# Altium project BaseBoard.PrjPcb (part 1 of 2)
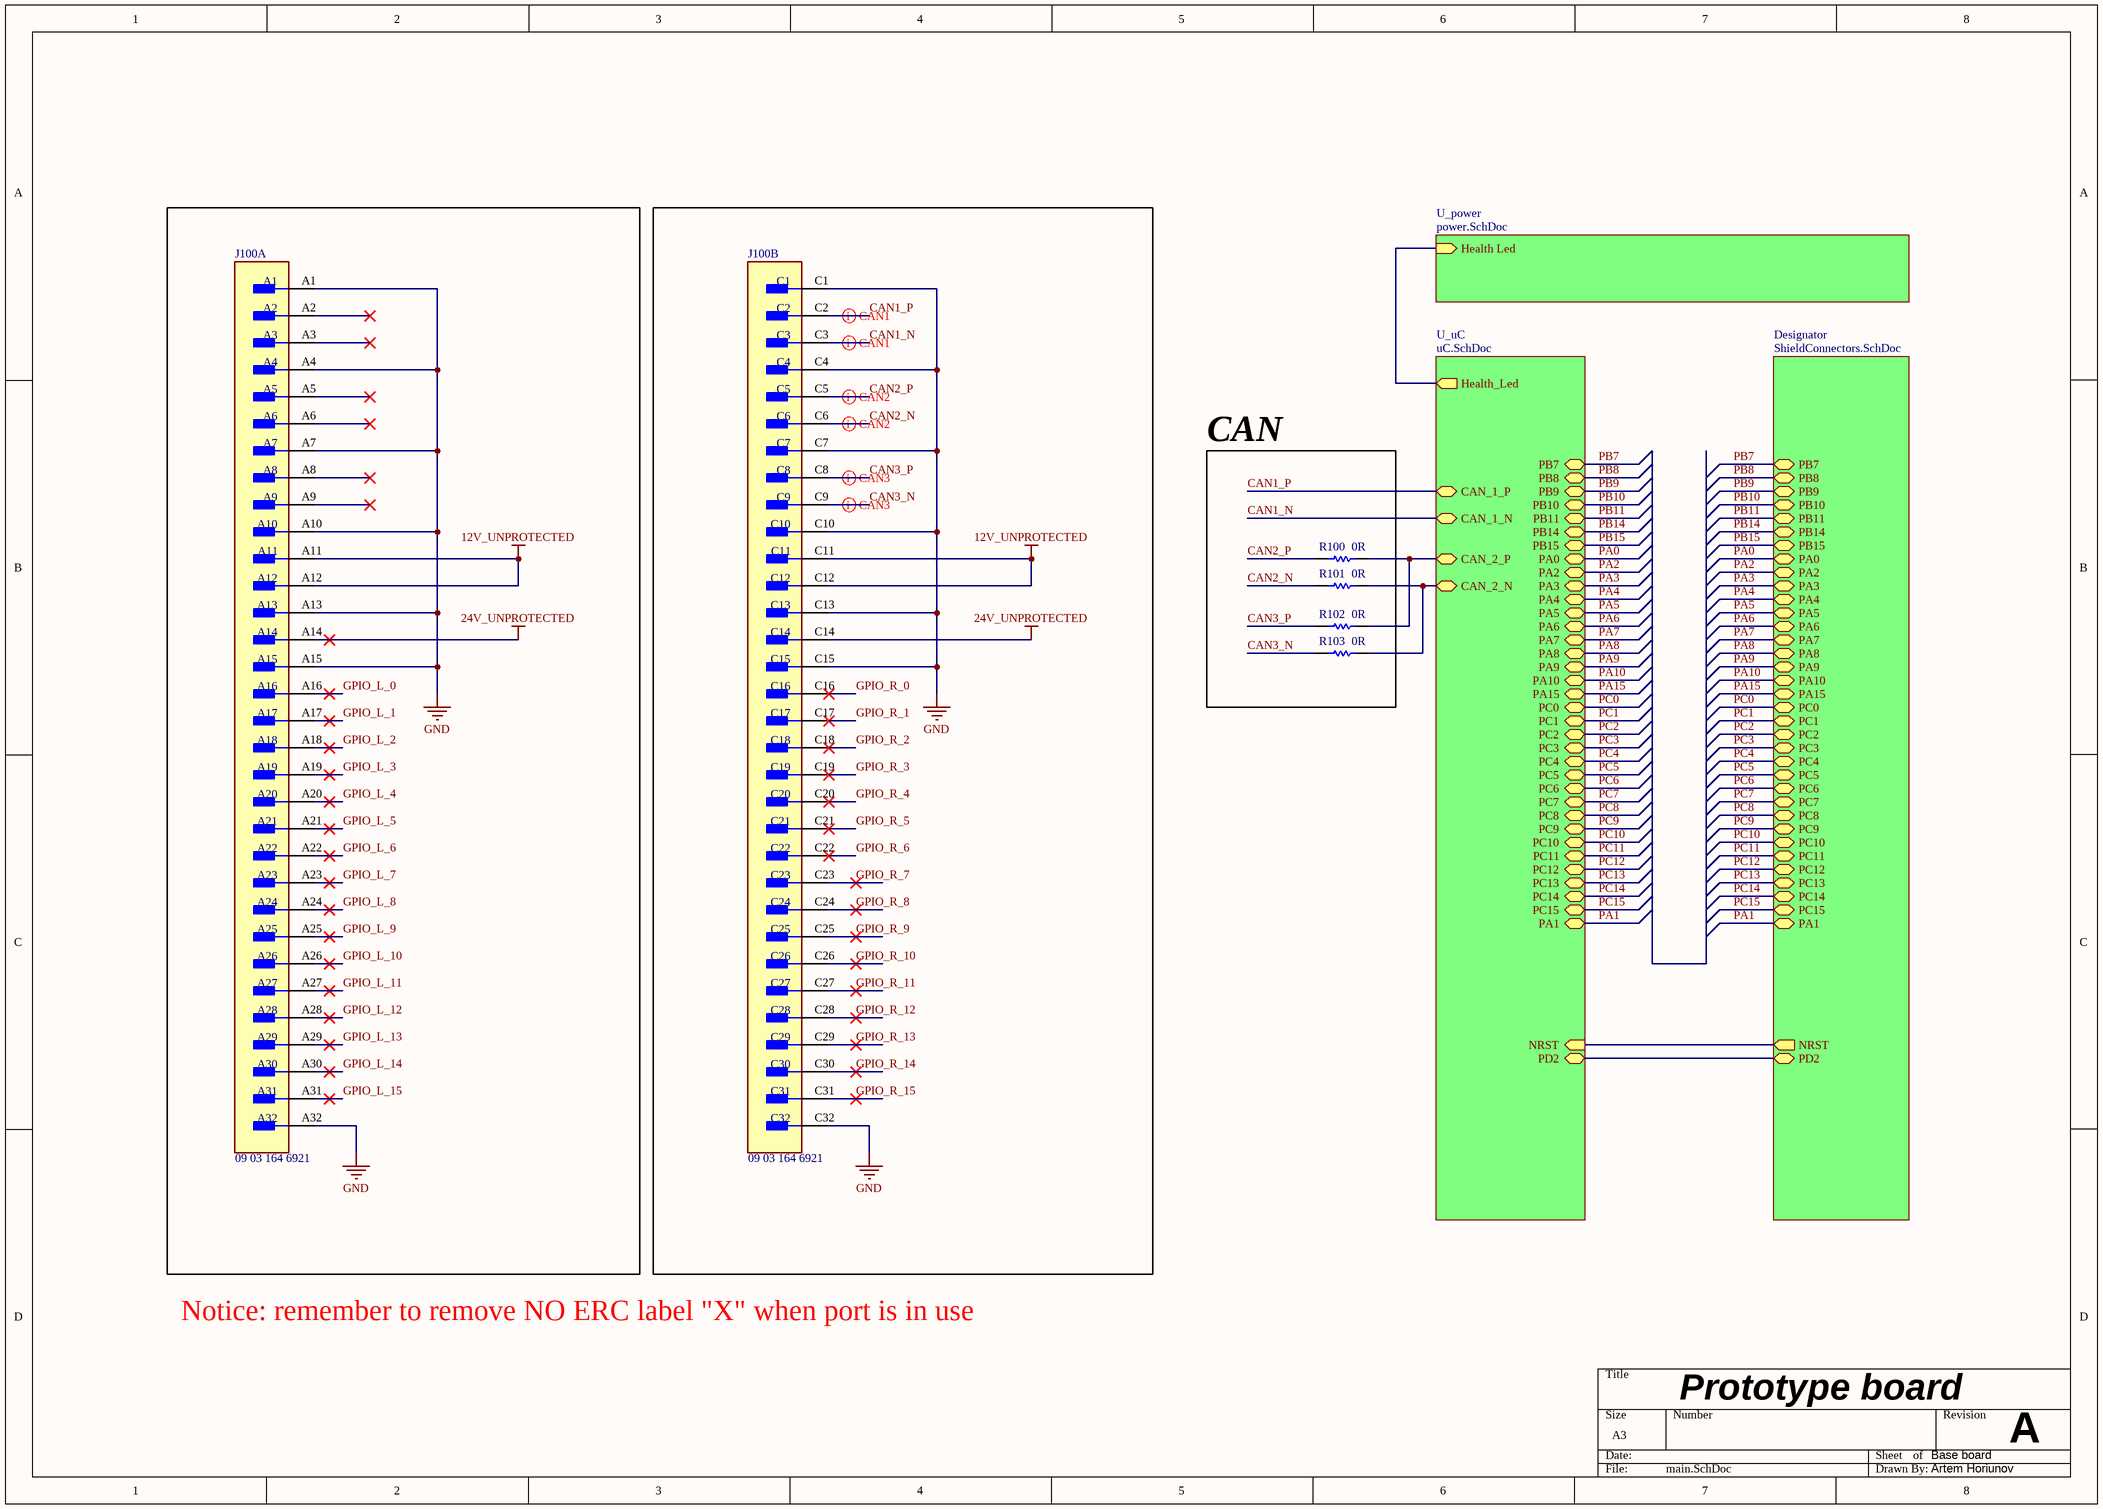
[diagram p0: main.SchDoc]
4 sheets, 129 parts. Net scope: hierarchical (ports join the sheet entries above them; power ports are global).
Board files: BaseBoard.PcbDoc, Buck3v3.PcbDoc, Buck5v.PcbDoc
Sheets:
  main.SchDoc
    U_power = power.SchDoc
    U_uC = uC.SchDoc
    Designator = ShieldConnectors.SchDoc

## Sheet main.SchDoc
size A3; SheetNumber: 1; SheetTotal: 4

### Parts
J100  09 03 164 6921  [FP-09_03_164_6921-MFG]  (parts A,B of 2)
R100  0R  [RESC1608X55X25ML10T15]
R101  0R  [RESC1608X55X25ML10T15]
R102  0R  [RESC1608X55X25ML10T15]
R103  0R  [RESC1608X55X25ML10T15]

### Blocks framed on the sheet
CAN: R100-R103

### Sub-sheets
Designator = ShieldConnectors.SchDoc: PB7 (bidir), PB8 (bidir), PB9 (bidir), PB10 (bidir), PB11 (bidir), PB14 (bidir), PB15 (bidir), PA0 (bidir), PA2 (bidir), PA3 (bidir), PA4 (bidir), PA5 (bidir), PA6 (bidir), PA7 (bidir), PA8 (bidir), PA9 (bidir), PA10 (bidir), PC5 (bidir), PC4 (bidir), PC7 (bidir), PC6 (bidir), PC1 (bidir), PC0 (bidir), PC3 (bidir), PC2 (bidir), PC8 (bidir), PC14 (bidir), PC13 (bidir), PA15 (bidir), PC15 (bidir), PC10 (bidir), PC9 (bidir), PC12 (bidir), PC11 (bidir), NRST (out), PD2 (bidir), PA1 (bidir)
U_power = power.SchDoc: Health Led (in)
U_uC = uC.SchDoc: CAN_2_P (bidir), CAN_2_N (bidir), CAN_1_P (bidir), CAN_1_N (bidir), Health_Led (out), PB7 (bidir), PB8 (bidir), PB9 (bidir), PB10 (bidir), PB11 (bidir), PB14 (bidir), PB15 (bidir), PA0 (bidir), PA2 (bidir), PA3 (bidir), PA4 (bidir), PA5 (bidir), PA6 (bidir), PA7 (bidir), PA8 (bidir), PA9 (bidir), PA10 (bidir), PA15 (bidir), PC0 (bidir), PC1 (bidir), PC2 (bidir), PC3 (bidir), PC4 (bidir), PC5 (bidir), PC6 (bidir), PC7 (bidir), PC8 (bidir), PC9 (bidir), PC10 (bidir), PC11 (bidir), PC12 (bidir), PC13 (bidir), PC14 (bidir), PC15 (bidir), PD2 (bidir), NRST (in), PA1 (bidir)

### Nets
12V_UNPROTECTED: J100.A11 J100.A12 J100.C11 J100.C12
24V_UNPROTECTED: J100.A14 J100.C14
GND: J100.A1 J100.A4 J100.A7 J100.A10 J100.A13 J100.A15 J100.A32 J100.C1 J100.C4 J100.C7 J100.C10 J100.C13 J100.C15 J100.C32
CAN1_N: J100.C3 ; sheet U_uC/CAN_1_N
CAN1_P: J100.C2 ; sheet U_uC/CAN_1_P
CAN2_N: J100.C6 R101.1
CAN2_P: J100.C5 R100.1
CAN3_N: J100.C9 R103.1
CAN3_P: J100.C8 R102.1
CAN_2_N: R101.2 R103.2 ; sheet U_uC/CAN_2_N
CAN_2_P: R100.2 R102.2 ; sheet U_uC/CAN_2_P
GPIO_L_0: J100.A16
GPIO_L_1: J100.A17
GPIO_L_2: J100.A18
GPIO_L_3: J100.A19
GPIO_L_4: J100.A20
GPIO_L_5: J100.A21
GPIO_L_6: J100.A22
GPIO_L_7: J100.A23
GPIO_L_8: J100.A24
GPIO_L_9: J100.A25
GPIO_L_10: J100.A26
GPIO_L_11: J100.A27
GPIO_L_12: J100.A28
GPIO_L_13: J100.A29
GPIO_L_14: J100.A30
GPIO_L_15: J100.A31
GPIO_R_0: J100.C16
GPIO_R_1: J100.C17
GPIO_R_2: J100.C18
GPIO_R_3: J100.C19
GPIO_R_4: J100.C20
GPIO_R_5: J100.C21
GPIO_R_6: J100.C22
GPIO_R_7: J100.C23
GPIO_R_8: J100.C24
GPIO_R_9: J100.C25
GPIO_R_10: J100.C26
GPIO_R_11: J100.C27
GPIO_R_12: J100.C28
GPIO_R_13: J100.C29
GPIO_R_14: J100.C30
GPIO_R_15: J100.C31
NRST: sheet U_uC/NRST, sheet Designator/NRST
PA0: sheet U_uC/PA0, sheet Designator/PA0
PA1: sheet U_uC/PA1, sheet Designator/PA1
PA2: sheet U_uC/PA2, sheet Designator/PA2
PA3: sheet U_uC/PA3, sheet Designator/PA3
PA4: sheet U_uC/PA4, sheet Designator/PA4
PA5: sheet U_uC/PA5, sheet Designator/PA5
PA6: sheet U_uC/PA6, sheet Designator/PA6
PA7: sheet U_uC/PA7, sheet Designator/PA7
PA8: sheet U_uC/PA8, sheet Designator/PA8
PA9: sheet U_uC/PA9, sheet Designator/PA9
PA10: sheet U_uC/PA10, sheet Designator/PA10
PA15: sheet U_uC/PA15, sheet Designator/PA15
PB7: sheet U_uC/PB7, sheet Designator/PB7
PB8: sheet U_uC/PB8, sheet Designator/PB8  [project net LV_CL]
PB9: sheet U_uC/PB9, sheet Designator/PB9  [project net LV_DA]
PB10: sheet U_uC/PB10, sheet Designator/PB10
PB11: sheet U_uC/PB11, sheet Designator/PB11
PB14: sheet U_uC/PB14, sheet Designator/PB14
PB15: sheet U_uC/PB15, sheet Designator/PB15
PC0: sheet U_uC/PC0, sheet Designator/PC0
PC1: sheet U_uC/PC1, sheet Designator/PC1
PC2: sheet U_uC/PC2, sheet Designator/PC2
PC3: sheet U_uC/PC3, sheet Designator/PC3
PC4: sheet U_uC/PC4, sheet Designator/PC4
PC5: sheet U_uC/PC5, sheet Designator/PC5
PC6: sheet U_uC/PC6, sheet Designator/PC6
PC7: sheet U_uC/PC7, sheet Designator/PC7
PC8: sheet U_uC/PC8, sheet Designator/PC8
PC9: sheet U_uC/PC9, sheet Designator/PC9
PC10: sheet U_uC/PC10, sheet Designator/PC10
PC11: sheet U_uC/PC11, sheet Designator/PC11
PC12: sheet U_uC/PC12, sheet Designator/PC12
PC13: sheet U_uC/PC13, sheet Designator/PC13
PC14: sheet U_uC/PC14, sheet Designator/PC14
PC15: sheet U_uC/PC15, sheet Designator/PC15
USER_LED_0: sheet U_power/Health Led, sheet U_uC/Health_Led
NetJ8_4: sheet U_uC/PD2, sheet Designator/PD2

Not connected (* = marked no-connect by the designer): J100 A2* A3* A5* A6* A8* A9*

### Layout directives
differential pair: CAN1_N, CAN1_P, CAN2_N, CAN2_P, CAN3_N, CAN3_P

### Notes on the sheet
- Notice: remember to remove NO ERC label "X" when port is in use
- Prototype board
- Base board
- A
- Artem Horiunov

### Library data of the parts
J100 = CMP-33111-000001-1: CONN DIN HDR 96POS PCB RA; Manufacturer: Harting; Pitch: 2.54mm; Number Of Contacts: 64; Current Rating: 2A; Conn Orientation: Right Angle; Conn Gender: Male; Device Class L1: Connectors; Package: 0; Number Of Rows: 2; ComponentLink2URL: https://b2b.harting.com/files/download/PRD/PDF_DS/09031200203_100580339DRW000B.pdf; Height: 11mm; Temperature Range Low: -55°C; Digikey Description: CONN DIN HDR 96POS PCB RA; Mouser Description: Conn DIN 41612 M 64 POS 2.54mm Solder RA Thru-Hole Box; Footprint Url: https://b2b.harting.com/files/download/PRD/PDF_TS/0903164X921_100072506DRW176A.pdf; Lead Free: Yes; RoHS: TRUE; Device Class L2: Backplane Connectors; Category: Conn; Manufacturer Part Number: 09 03 164 6921; Temperature Range High: +125°C; Temperature: -55°C to +125°C; ComponentLink2Description: Datasheet; Octopart: https://octopart.com/09031646921-harting+elektronik-42933; Device Class L3: unset; Automotive: No; Contact Material: Gold,Nickel
R100-R103 = CMP-2100-03667-1: Chip Resistor, 0 Ohm, +/- 5%, 0.1 W, -55 to 155 degC, 0603 (1608 Metric), RoHS, Tape and Reel; Manufacturer: Yageo; Temperature Coefficient: 200ppm/degreesC; Voltage Rating: 50V; Power Rating: 100mW; Resistance: 0mOhm; Width: 0.8mm; Max Operating Temperature: 155degC; Tolerance: 5%; Package Reference: 0603; Height: 0.45mm; Depth: 0.8mm; Package Description: 2-Pin Surface Mount Device, Body 1.6 x 0.8 mm; Termination: SMD/SMT; Package Quantity: 5000; Case/Package: 0603; Case Code (Imperial): 0603; Radiation Hardening: No; Number of Pins: 2; Length: 1.6mm; Lead Free: LeadFree; Voltage Rating (DC): 50V; Military Standard: Not; Datasheet URL: http://www.yageo.com/NewPortal/yageodocoutput?fileName=/pdf/R-Chip/PYu-RC_Group_51_RoHS_L_5.pdf; Manufacturer URL: http://www.yageo.com/; Packaging: TapeandReel; Case Code (Metric): 1608; Min Operating Temperature: -55degC; Composition: ThickFilm; RoHSCompliant: true; Contact Plating: Tin; Datasheet Version: Rev. 5, 10/2016; REACH SVHC: NoSVHC

## Sheet power.SchDoc
size A3; SheetNumber: 3; SheetTotal: 4
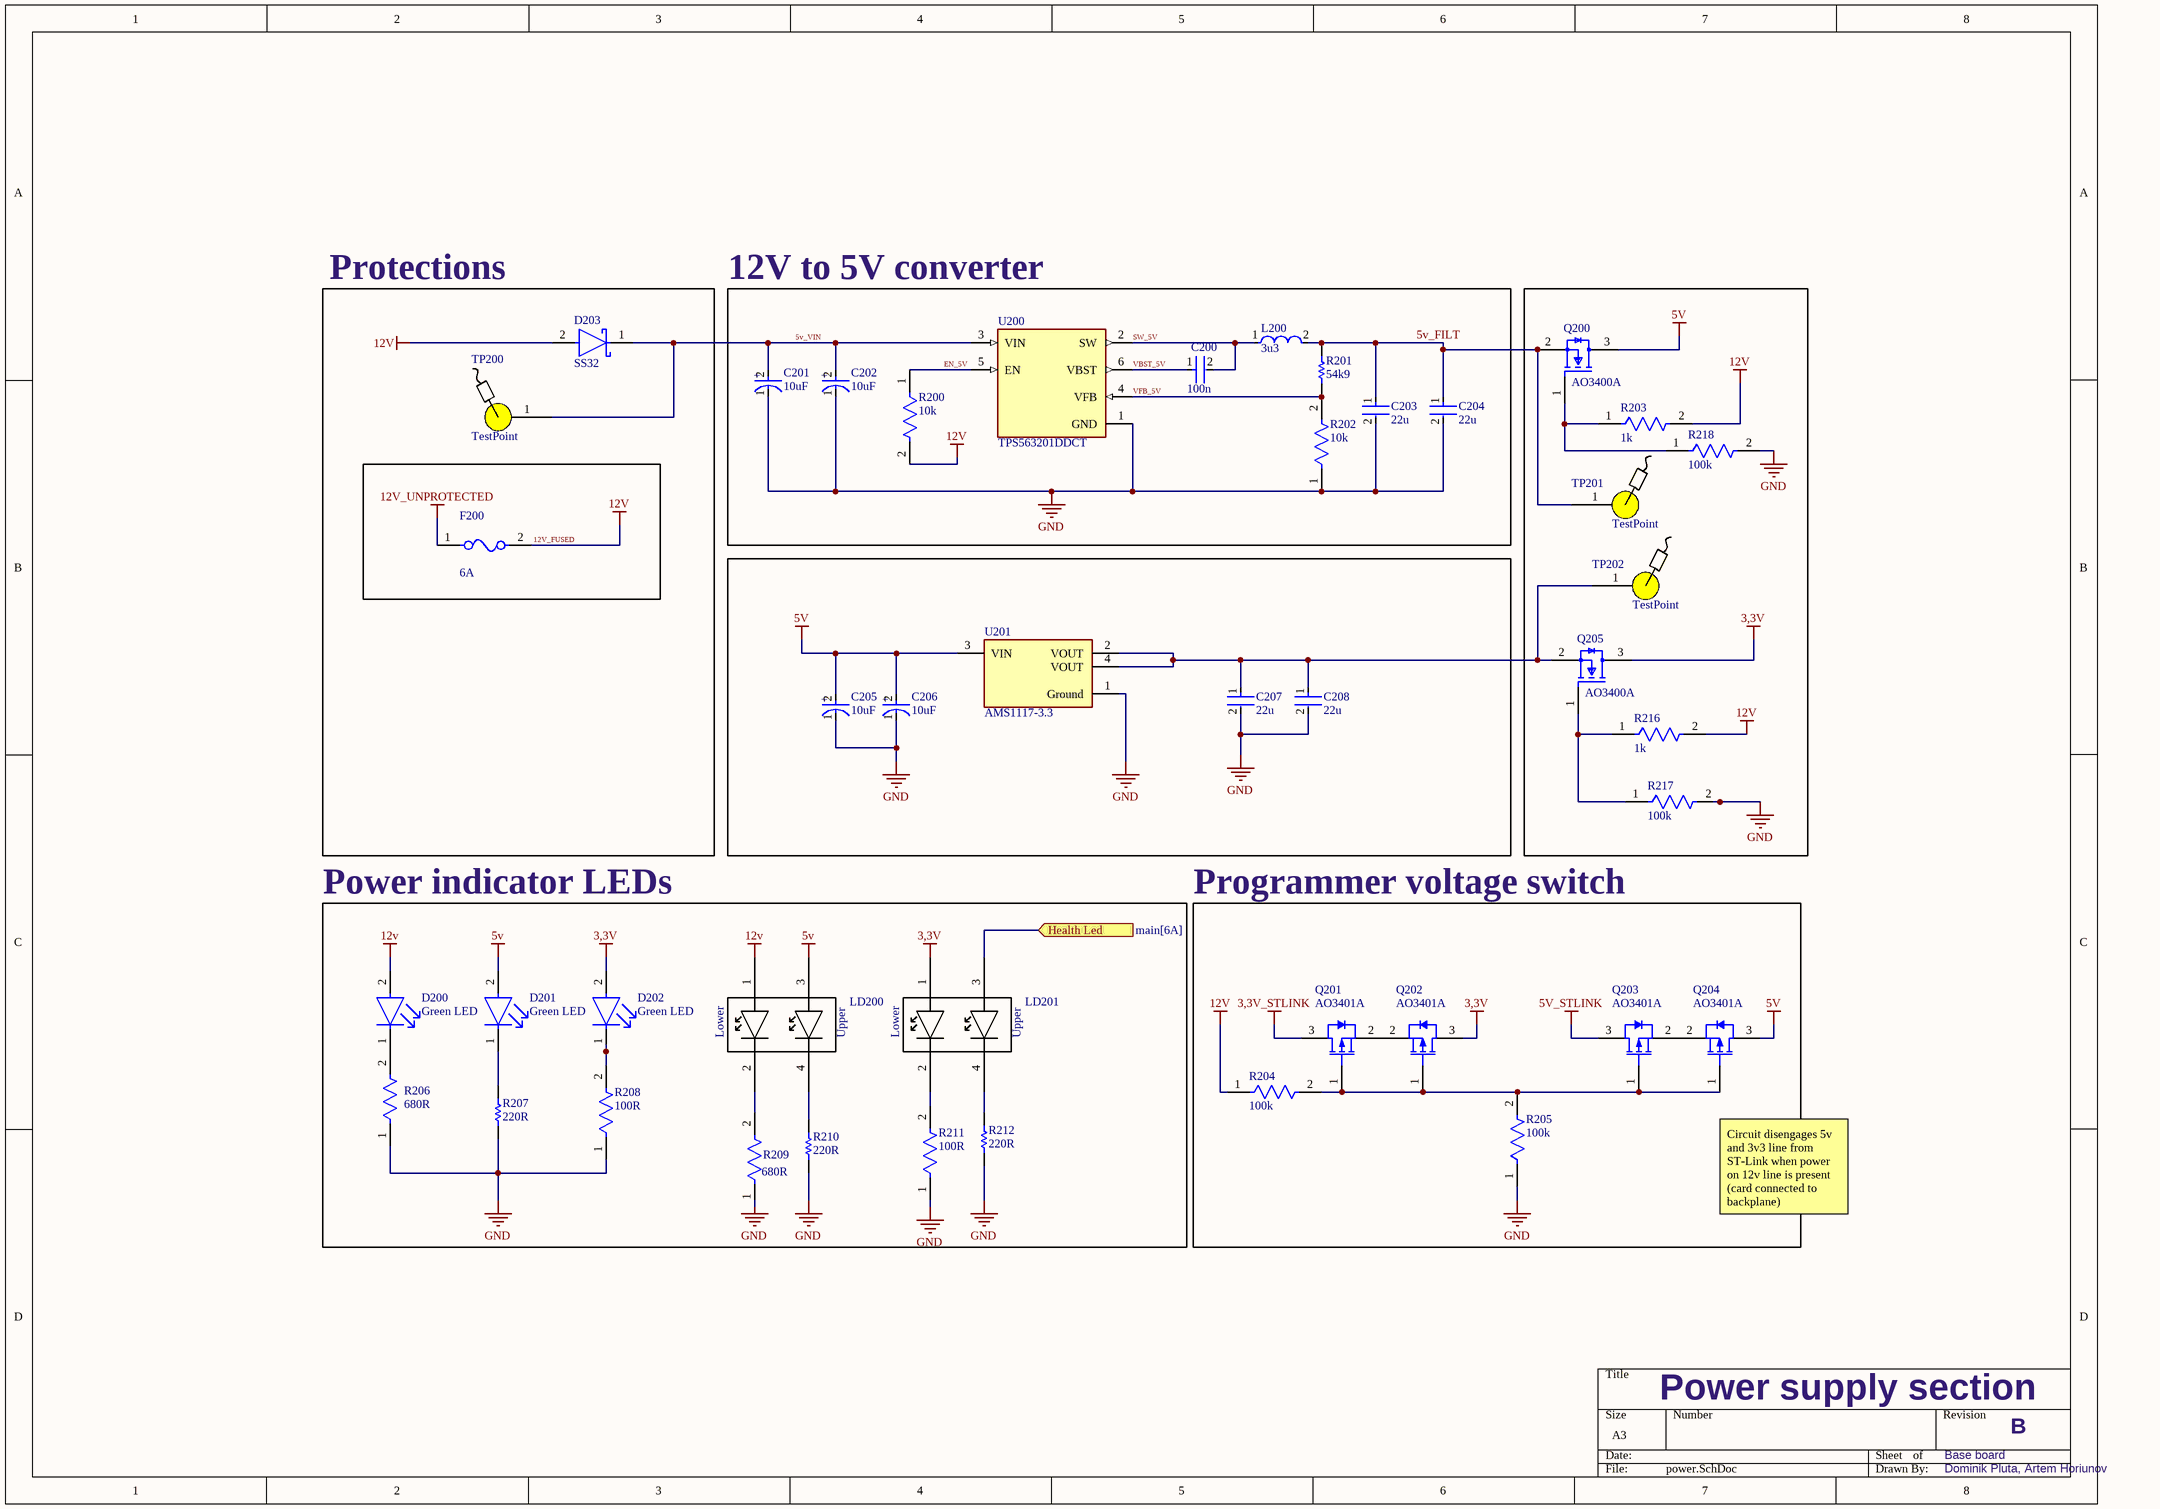
[diagram p1: power.SchDoc]

### Parts
C200  100n  [FP-C0603C-CF-MFG]
C201  10uF  [FP-POSCAP-B2-MFG]
C202  10uF  [FP-POSCAP-B2-MFG]
C203  22u  [FP-C3216-085-0_2-MFG]
C204  22u  [FP-C3216-085-0_2-MFG]
C205  10uF  [FP-POSCAP-B2-MFG]
C206  10uF  [FP-POSCAP-B2-MFG]
C207  22u  [FP-C3216-085-0_2-MFG]
C208  22u  [FP-C3216-085-0_2-MFG]
D200  Green LED  [FP-HSME-C191-MFG]
D201  Green LED  [FP-HSME-C191-MFG]
D202  Green LED  [FP-HSME-C191-MFG]
D203  SS32  [FP-403AG-MFG]
F200  6A  [FP-0466-MFG]
L200  3u3  [FP-SRP4020TA-MFG]
LD200  (no value)  [LED_HOLDER]
LD201  (no value)  [LED_HOLDER]
Q200  AO3400A  [FP-SOT23-MFG]
Q201  AO3401A  [AO-SOT-23-3L_V]
Q202  AO3401A  [AO-SOT-23-3L_V]
Q203  AO3401A  [AO-SOT-23-3L_V]
Q204  AO3401A  [AO-SOT-23-3L_V]
Q205  AO3400A  [FP-SOT23-MFG]
R200  10k  [FP-RC0603-0_55-IPC_C]
R201  54k9  [RESC1608X55X30LL15T15]
R202  10k  [FP-RC0603-0_55-IPC_C]
R203  1k  [FP-ERA3A-IPC_C]
R204  100k  [FP-RC0603-0_55-MFG]
R205  100k  [FP-RC0603-0_55-MFG]
R206  680R  [FP-CRCW0603-e3-MFG]
R207  220R  [RESC1608X55X25ML10T15]
R208  100R  [FP-RC0603-0_55-MFG]
R209  680R  [FP-CRCW0603-e3-MFG]
R210  220R  [RESC1608X55X25ML10T15]
R211  100R  [FP-RC0603-0_55-MFG]
R212  220R  [RESC1608X55X25ML10T15]
R216  1k  [FP-ERA3A-IPC_C]
R217  100k  [FP-RC0603-0_55-MFG]
R218  100k  [FP-RC0603-0_55-MFG]
TP200  TestPoint  [TestPoint]  (no BOM)
TP201  TestPoint  [TestPoint]  (no BOM)
TP202  TestPoint  [TestPoint]  (no BOM)
U200  TPS563201DDCT  [SOT95P280X110-6N]
U201  AMS1117-3.3  [FP-AMS1117-IPC_C]

### Blocks framed on the sheet
Protections: D203 F200 TP200
12V to 5V converter: C200-C204 L200 R200-R202 U200
Power indicator LEDs: D200-D202 LD200 LD201 R206-R212
Programmer voltage switch: Q201-Q204 R204 R205

### Ports
Health Led (in, see main[6A])

### Nets
3,3V: D202.2(A) LD201.1 Q202.3(DRAIN) Q205.3(D)
3,3V_STLINK: Q201.3(DRAIN)
5V: C205.2(A) C206.2(A) D201.2(A) LD200.3 Q200.3(D) Q204.3(DRAIN) U201.3(VIN)
5V_STLINK: Q203.3(DRAIN)
12V_FUSED: D200.2(A) D203.2(A) F200.2 LD200.1 R200.2 R203.2 R204.1 R216.2  [also labelled 12v]
12V_UNPROTECTED: F200.1
GND: C201.1(C) C202.1(C) C203.2 C204.2 C205.1(C) C206.1(C) C207.2 C208.2 R202.1 R205.1 R206.1 R207.1 R208.1 R209.1 R210.1 R211.1 R212.1 R217.2 R218.2 U200.1(GND) U201.1(Ground)
5v_FILT: C203.1 C204.1 L200.2 Q200.2(S) R201.2 TP201.1
5v_VIN: C201.2(A) C202.2(A) D203.1(C) TP200.1 U200.3(VIN)
EN_5V: R200.1 U200.5(EN)
SW_5V: C200.2 L200.1 U200.2(SW)
USER_LED_0: LD201.3 ; port Health Led
VBST_5V: C200.1 U200.6(VBST)
VFB_5V: R201.1 R202.2 U200.4(VFB)
NetC207_1: C207.1 C208.1 Q205.2(S) TP202.1 U201.2(VOUT) U201.4(VOUT)
NetD200_1: D200.1(C) R206.2
NetD201_1: D201.1(C) R207.2
NetD202_1: D202.1(C) R208.2
NetLD200_2: LD200.2 R209.2
NetLD200_4: LD200.4 R210.2
NetLD201_2: LD201.2 R211.2
NetLD201_4: LD201.4 R212.2
NetQ200_1: Q200.1(G) R203.1 R218.1
NetQ201_1: Q201.1(GATE) Q202.1(GATE) Q203.1(GATE) Q204.1(GATE) R204.2 R205.2
NetQ201_2: Q201.2(SOURCE) Q202.2(SOURCE)
NetQ203_2: Q203.2(SOURCE) Q204.2(SOURCE)
NetQ205_1: Q205.1(G) R216.1 R217.1

### Notes on the sheet
- Circuit disengages 5v and 3v3 line from ST-Link when power on 12v line is present (card connected to backplane)
- Power supply section
- Base board
- B
- Dominik Pluta, Artem Horiunov
- (in symbol CMP-05428-001070-1) +
- (in symbol DoubleStack_Side_Led_3mm) Lower; Upper

### Library data of the parts
C200 = CMP-2006-03061-2: CAP CER 0.1UF 50V X7R 0603; Manufacturer: KEMET; Manufacturer Part Number: C0603C104K5RACTU; Tolerance: 0.1; Temperature Coefficient: 30ppm/°C; Material: Ceramic; Automotive Grade: Grade 1; Value: 0.10 μF; Temperature: -55°C to +125°C; RoHS: TRUE; Temperature Range High: +125°C; Lead Free: Yes; Octopart: https://octopart.com/c0603c104k5ractu-kemet-139244; Digikey Description: CAP CER 0.1UF 50V X7R 0603; Category: Cap; Package: C0603C-CF; ComponentLink2Description: Datasheet; Temperature Range Low: -55°C; Device Class L1: Passive Components; Voltage Rating: 50 V; Automotive: Yes; Device Class L3: Ceramic Capacitors; ComponentLink2URL: https://api.kemet.com/component-edge/download/datasheet/C0603C100J5GACAUTO.pdf; Capacitance: 0.10 μF; Device Class L2: Capacitors; Temperature Characteristic: X7R; Height: 0.87mm
C201 C202 C205 C206 = CMP-05428-001070-1: Molded Tantalum Polymer Capacitor 10uF 20% 16V life 2000Hours SMD 1411; Leakage Current: 48uA; ESR (Equivalent Series Resistance): 100mR; Ripple Current: 800mA; Dissipation Factor: 10%; Polarity: Polar; Voltage Rating: 16V; REACH SVHC: No SVHC; Width: 2.8mm; Construction: Flat; Features: General Purpose; Life (Hours): 2000Hour; Radiation Hardening: No; Length: 3.5mm; Termination: SMD/SMT; Series: POSCAP™ TQC; Voltage Rating (DC): 16V; Mount: Surface Mount; Min Operating Temperature: -55°C; Lead Free: Lead Free; Tolerance: 20%; Number of Pins: 2; Case/Package: 1411; Case Code (Metric): 3528; Height: 1.9mm; Height - Seated (Max): 0.083inch; Package Quantity: 2000; Capacitance: 10uF; RoHS Compliant: Yes; Case Code (Imperial): 1210; Packaging: Tape and Reel; Voltage: 16V; Max Operating Temperature: 105°C; Depth: 2.8mm
C203 C204 C207 C208 = CMP-08246-004858-1: Multilayer Ceramic Capacitors 22μF ±20% 6.3V X5R SMD 1206; Capacitance: 22uF; RoHS Compliant: Yes; Case/Package: 1206; Length: 0.126inch; Thickness: 0.037inch; Min Operating Temperature: -55°C; REACH SVHC: No SVHC; Number of Pins: 2; Weight: 0.000571oz; Resistor Type: Ceramic; Dielectric: X5R; Tolerance: 20%; Max Operating Temperature: 85°C; Package Quantity: 1; Series: C; Depth: 1.6mm; Width: 0.063inch; Lead Free: Lead Free; Dielectric Material: Ceramic; Case Code (Imperial): 1206; Mount: Surface Mount; Voltage Rating: 6.3V; Voltage Rating (DC): 6.3V; Case Code (Metric): 3216; Height: 0.85mm; Packaging: Cut Tape; Termination: SMD/SMT
D200-D202 = CMP-18399-000013-1: LED GREEN DIFFUSED 0603 SMD; Manufacturer: Broadcom; Manufacturer Part Number: HSME-C191; Forward Current: 20mA; Reverse Voltage: 5V; Forward Voltage: 2.1V; Viewing Angle: 170°; Wavelength: 572nm; Power Dissipation: 52mW; Max Junction Temp: +95°C; Luminous Intensity: 50mcd; Led Orientation: Top View; Peak Emmision Wavelength: 570nm; Package: 0; Category: Diode; ComponentLink2URL: https://docs.broadcom.com/docs/AV02-0976EN; ComponentLink2Description: Datasheet; Device Class L2: LEDs; Digikey Description: LED GREEN DIFFUSED 0603 SMD; Height: 0.7mm; RoHS: TRUE; Colour: Green; Lead Free: Yes; Device Class L1: Optoelectronics; Device Class L3: unset; Temperature Range High: +85°C; Automotive: No; Temperature: -40°C to +85°C; Octopart: https://octopart.com/hsme-c191-broadcom-71131261; Mouser Description: Standard LEDs - SMD AlInGaP Green; Temperature Range Low: -40°C
D203 = CMP-00278-84331622-1: SS32 Rectifier Diode, Schottky, 1 Phase, 1 Element, 3A, 20V V(RRM), Silicon, DO-214AB; Manufacturer Lifecycle Status: ACTIVE; Forward Voltage: 500mV; Max Forward Surge Current (Ifsm): 100A; Max Reverse Leakage Current: 500µA; Max Junction Temperature (Tj): 150°C; Element Configuration: Single; Max Power Dissipation: 2.27W; Polarity: Standard; Number of Elements: 1; RoHS: Compliant; Forward Current: 3A; Height: 2.65mm; Max Reverse Voltage (DC): 20V; NexarPartId: 84331622; Max Repetitive Reverse Voltage (Vrrm): 20V; Schedule B: 8541100080, 8541100080; Lead Free: Lead Free; Current Rating: 3A; Radiation Hardening: No; Mount: Surface Mount; Max Operating Temperature: 150°C; Average Rectified Current: 3A; Number of Pins: 2; Output Current: 3A; Packaging: Cut Tape; Min Operating Temperature: -55°C; Max Surge Current: 100A; REACH SVHC: No SVHC; Case/Package: SMC; Weight: 300mg; Lifecycle Status: Production; Peak Reverse Current: 500µA; Number of Terminals: 2; Width: 6.25mm; Length: 7.15mm; Voltage Rating (DC): 20V; Peak Non-Repetitive Surge Current: 100A
F200 = CMP-08605-000093-1: Voltage Rating: 63V; Body Material: Thermoplastic; Fuse Type: Board Mount (Cartridge Style Excluded); Resistance: 220mR; Current Rating: 750mA; DC Cold Resistance: 111mR; Approvals: UL; Package Quantity: 5000; Radiation Hardening: No; Width: 0.06inch; Mount: Surface Mount; Case Code (Metric): 3216; Length: 3.18mm; Depth: 1.52mm; Series: 466; Voltage Rating (AC): 63V; Case Code (Imperial): 1206; Voltage Rating (DC): 63V; Min Operating Temperature: -55°C; Height: 0.023inch; Working Voltage: 63V; RoHS Compliant: Yes; Packaging: Tape and Reel; Number of Pins: 2; Lead Free: Lead Free; Case/Package: 1206; Max Operating Temperature: 90°C; Termination: SMD/SMT; Fuse Current: 750mA
L200 = CMP-07248-000008-1: MDA4020-3R3M / 3.3uH ±20% 3.1A 65mΩ SMD,4.1x4.5mm Inductors (SMD) ROHS; Manufacturer: Bourns; Manufacturer Part Number: SRP4020TA-3R3M; Shielding: true; Test Frequency: 100kHz; Self Resonant Frequency: 40MHz; Saturation Current: 4A; Q Factor: 10; Series Resistance: 76mΩ; Automotive Grade: Grade 0; Core Material: Carbonyl Powder; Rms Current: 3.5A; Temperature Range High: +150°C; Height: 2.1mm; Temperature: -40°C to +150°C; RoHS: TRUE; Device Class L3: Fixed Inductors; Automotive: Yes; Octopart: https://octopart.com/srp4020ta-3r3m-bourns-47300338; Composition: Wirewound; Mouser Description: Ind Power Shielded Wirewound 3.3uH 20% 100KHz Carbonyl Powder 3.5A T/R; Category: Ind; ComponentLink2Description: Datasheet; ComponentLink2URL: https://www.bourns.com/docs/Product-Datasheets/SRP4020TA.pdf; Digikey Description: FIXED IND 3.3UH 3.5A 76 MOHM SMD; Lead Free: Yes; Temperature Range Low: -40°C; Inductance: 3.3uH; Tolerance: 20%; Package: SRP4020TA; Value: 3.3uH; Device Class L1: Passive Components; Device Class L2: Inductors
LD200 LD201 = DoubleStack_Side_Led_3mm
Q200 Q205 = CMP-83955-000006-1: MOSFET N-CH 30V 5.7A SOT23; Input Capacitance: 630pF; Number of Elements: 1; Rds On Max: 26.5mR; Max Power Dissipation: 1.4W; Gate to Source Voltage (Vgs): 12V; Min Operating Temperature: -55°C; Lead Free: Lead Free; Number of Pins: 3; Drain to Source Voltage (Vdss): 30V; Case/Package: SOT-23; Mount: Surface Mount; Continuous Drain Current (ID): 5.7A; Radiation Hardening: No; Packaging: Tape and Reel; Max Operating Temperature: 150°C; Power Dissipation: 1.4W
Q201-Q204 = CMP-2000-05778-1: P-Channel MOSFET, 30 V, 4 A, -55 to 150 degC, 3-Pin SOT-23-3L, RoHS, Tape and Reel; Manufacturer: Alpha and Omega; Output Power (Max): NotRequiredW; Power Dissipation: 1.4W; Rad Hardened: No; Drain Efficiency: NotRequired%; Drain-Source On-Volt: 30V; Noise Figure: NotRequireddB; Frequency (Max): NotRequiredMHz; Number of  Elements: 1; Gate-Source Voltage (Max): ?12V; Drain Current (Max): 4A; Channel Mode: Enhancement; Drain-Source On-Res: 0.044ohm; Type: PowerMOSFET; Polarity: P; Package URL: http://www.aosmd.com/res/packaging_information/SOT-23-3L.pdf; Datasheet URL: http://www.aosmd.com/res/data_sheets/AO3401A.pdf; Package Type: SOT-23; Package Description: 3-Pin Small Outline Transistor, Body 2.95 x 1.6 mm, Pitch 0.95 mm; Mounting: SurfaceMount; Manufacturer URL: http://www.aosmd.com/; Continuous Drain Current: 4A; Package Reference: SOT-23-3L; Mounting Technology: SurfaceMount; Operating Temperature Classification: Military; Power Gain: NotRequireddB; Datasheet Version: Rev. 3, 03/2011; Operating Temp Range: -55Cto150C; Pin Count: 3
R200 R202 = CMP-2100-03664-2: RES 10K OHM 1% 1/10W 0603; Voltage Rating: 75V; Voltage Rating (DC): 50V; Resistance: 10kR; Power Rating: 100mW; Temperature Coefficient: 100ppm/°C; Depth: 0.8mm; Termination: SMD/SMT; Resistor Type: Thick Film; Series: RC; Construction: Rectangular; Features: Moisture Resistant; Packaging: Tape and Reel; Min Operating Temperature: -55°C; Number of Terminations: 2; Lead Pitch: 0.3mm; RoHS Compliant: Yes; Case/Package: 0603; Resistance Tolerance: 1%; Military Standard: Not; Weight: 7.1E-05oz; Number of Pins: 2; Tolerance: 1%; Length: 1.6mm; Case Code (Imperial): 0603; Lead Free: Lead Free; Width: 0.8mm; Max Power Dissipation: 100mW; Height: 0.45mm; Max Operating Temperature: 155°C; Case Code (Metric): 1608; Size Code: 0603
R201 = CMP-2000-00561-1: Manufacturer: Panasonic; Part Number: ERJ-3EKF5492V
R203 R216 = CMP-2000-00873-2: RES SMD 1K OHM 0.1% 1/10W 0603; Temperature Coefficient: 25ppm/°C; Voltage Rating: 75V; Max Power Dissipation: 100mW; Resistance: 1kR; Technology: METAL FILM; Number of Pins: 2; Packaging: Tape and Reel; Case Code (Imperial): 0603; Case Code (Metric): 1608; Min Operating Temperature: -55°C; REACH SVHC: No SVHC; Length: 1.6mm; Termination: SMD/SMT; Depth: 0.8mm; Resistance Tolerance: 0.1%; Number of Terminations: 2; Width: 0.8mm; Military Standard: Not; Tolerance: 0.1%; Package Quantity: 5000; Contact Plating: Tin; Height: 0.45mm; Construction: Rectangular; Case/Package: 0603; Max Operating Temperature: 155°C; Resistor Type: Thin Film; Series: ERA-3A; Size Code: 0603; RoHS Compliant: Yes; Mount: Surface Mount; Radiation Hardening: No; Power Rating: 100mW
R204 R205 R217 R218 = CMP-2100-03662-2: RES SMD 100K OHM 1% 1/10W 0603; Voltage Rating (DC): 50V; Resistance: 100kR; Max Power Dissipation: 100mW; Temperature Coefficient: 100ppm/°C; Working Voltage: 75V; Length: 1.6mm; Lead Free: Lead Free; Number of Terminations: 2; Packaging: Tape and Reel; Voltage Rating: 50V; Termination: SMD/SMT; Width: 0.8mm; Resistor Type: Thick Film; Resistance Tolerance: 1%; Features: Moisture Resistant; Height: 0.45mm; Construction: Rectangular; Case/Package: 0603; Military Standard: Not; Case Code (Imperial): 0603; Series: RC; Technology: THICK FILM; Depth: 0.8mm; RoHS Compliant: Yes; REACH SVHC: No SVHC; Min Operating Temperature: -55°C; Case Code (Metric): 1608; Max Operating Temperature: 155°C; Power Rating: 100mW; Number of Pins: 2; Tolerance: 1%
R206 R209 = CMP-2000-03529-2: RES Thick Film, 680Ω, 1%, 0.1W, 100ppm/°C, 0603; Voltage Rating (DC): 75V; Max Power Dissipation: 100mW; Radiation Hardening: No; Case Code (Imperial): 0603; Number of Pins: 2; Termination: SMD/SMT; Lead Free: Lead Free; Contact Plating: Tin; Case Code (Metric): 1608; Max Operating Temperature: 155°C; Tolerance: 1%; Military Standard: Not; Features: Automotive AEC-Q200; Power Rating: 100mW; Width: 0.85mm; Depth: 0.85mm; Resistance: 680R; Height: 0.45mm; Case/Package: 0603; Min Operating Temperature: -55°C; Length: 1.55mm; Voltage Rating: 75V; Composition: Thick Film; Working Voltage: 75V; Temperature Coefficient: 100ppm/°C; Packaging: Tape and Reel; Package Quantity: 10; Weight: 7.1E-05oz; Number of Terminations: 2
R207 R210 R212 = CMP-1659-00018-2: General Purpose Chip Resistors, 220 Ohm, +/- 1%, -55 to 155 degC, 0603 (1608 Metric), RoHS, Tape and Reel; RoHSCompliant: false; DatasheetVersion: Rev. 4, 04/2009; ComponentLink2Description: Datasheet; ComponentLink2URL: https://datasheet.ciiva.com/11808/0900766b80f96399-11808136.pdf; ComponentLink1URL: http://www.yageo.com/; ComponentLink1Description: Manufacturer URL; PackageReference: 0603; PackageDescription: 2-Pin Surface Mount Device, Body 1.6 x 0.8 mm
R208 R211 = CMP-2100-03663-2: NexarPartId: 55402879; Voltage Rating: 50V; Power Rating: 100mW; Tolerance: 1%; Temperature Coefficient: 100ppm/°C; Resistance: 100Ω; Case/Package: 0603; Military Standard: Not; REACH SVHC: Unknown; Case Code (Metric): 0603; Max Operating Temperature: 155°C; Schedule B: 8533210045, 8533210045; Height: 450µm; Length: 1.6mm; Lead Free: Lead Free; Packaging: Tape & Reel; Case Code (Imperial): 0603; Composition: Thick Film; Min Operating Temperature: -55°C; Voltage Rating (DC): 50V; RoHS: Compliant; Depth: 800µm; Number of Pins: 2; Termination: SMD/SMT; Width: 800µm
U200 = CMP-007-000000-1: Design Item ID: TPS563201DDCT; Component Type: Standard; Price: None; MP: TPS563201DDCT; Package: None; Source: TPS563201DDCT.SchLib; Value: *; Pin Count: 6; Availability: Unavailable
U201 = CMP-209535-000001-1: LDO Voltage Regulators 1A, 3.3V; Manufacturer: Advanced Monolithic Systems; Dropout Voltage: 1.1V; Output Type: Fixed; Nominal Supply Current: 5mA; Max Power Dissipation: 1.2W; Max Supply Voltage: 15V; Number Of Outputs: 1; Standoff Height: 0.64mm; Max Junction Temp: +125°C; Height: 1.8mm; Package: AMS1117; Device Class L2: Power Management ICs; ComponentLink2Description: Datasheet; ComponentLink2URL: http://www.advanced-monolithic.com/pdf/ds1117.pdf; Category: IC; RoHS: TRUE; Automotive: No; Device Class L1: Integrated Circuits (ICs); Output Current: 1A; Device Class L3: Voltage Regulators - Linear; Temperature: -40°C to +125°C; Output Voltage: 3.3V; Manufacturer Part Number: AMS1117-3.3; Temperature Range Low: -40°C; Octopart: https://octopart.com/ams1117-3.3-advanced+monolithic+systems-25899300; Lead Free: Yes; Ipc Land Pattern Name: SOT229P700X180-4; Temperature Range High: +125°C

## Sheet uC.SchDoc
size A3; SheetNumber: 2; SheetTotal: 4
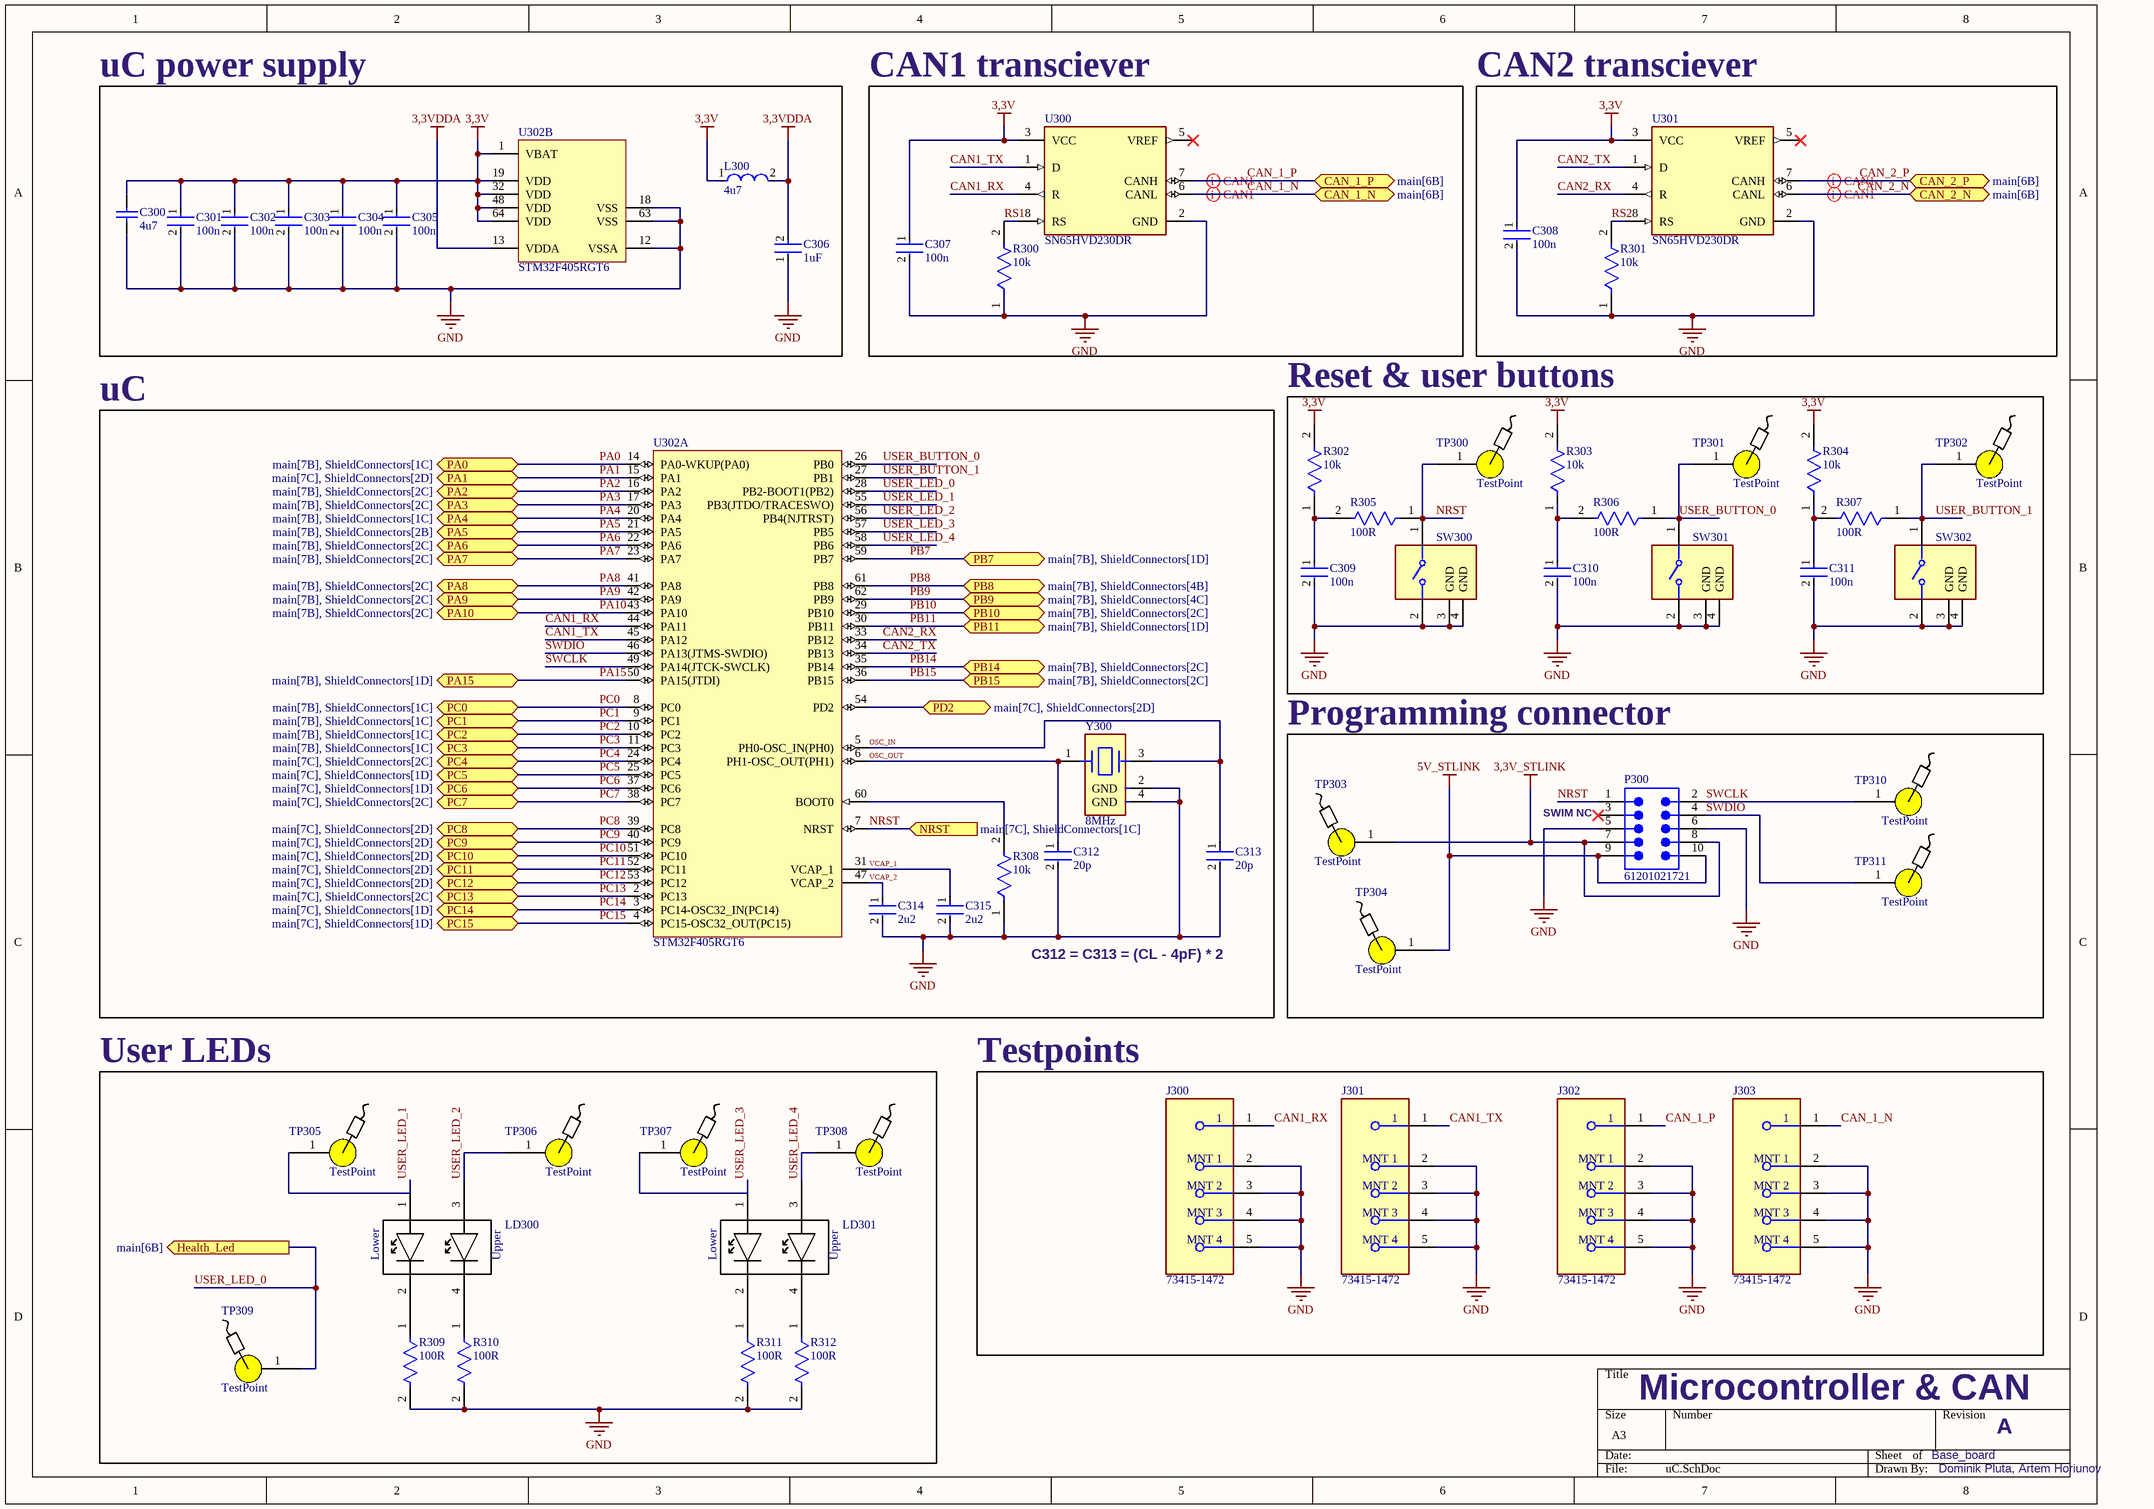
[diagram p2: uC.SchDoc]

### Parts
C300  4u7  [CAPC1608X87X35NL15T15]
C301  100n  [FP-C0603C-CF-MFG]
C302  100n  [FP-C0603C-CF-MFG]
C303  100n  [FP-C0603C-CF-MFG]
C304  100n  [FP-C0603C-CF-MFG]
C305  100n  [FP-C0603C-CF-MFG]
C306  1uF  [FP-C1608-080-0_1-IPC_B]
C307  100n  [FP-C0603C-CF-MFG]
C308  100n  [FP-C0603C-CF-MFG]
C309  100n  [FP-C0603C-CF-MFG]
C310  100n  [FP-C0603C-CF-MFG]
C311  100n  [FP-C0603C-CF-MFG]
C312  20p  [FP-C0603C-CF-MFG]
C313  20p  [FP-C0603C-CF-MFG]
C314  2u2  [FP-GRM188-0_1-e0_2_0_5-MFG]
C315  2u2  [FP-GRM188-0_1-e0_2_0_5-MFG]
J300  73415-1472  [FP-73415-1472-MFG]
J301  73415-1472  [FP-73415-1472-MFG]
J302  73415-1472  [FP-73415-1472-MFG]
J303  73415-1472  [FP-73415-1472-MFG]
L300  4u7  [FP-LQM21DH_70-IPC_C]
LD300  (no value)  [LED_HOLDER]
LD301  (no value)  [LED_HOLDER]
P300  61201021721  [61201021721]
R300  10k  [FP-RC0603-0_55-IPC_C]
R301  10k  [FP-RC0603-0_55-IPC_C]
R302  10k  [FP-RC0603-0_55-IPC_C]
R303  10k  [FP-RC0603-0_55-IPC_C]
R304  10k  [FP-RC0603-0_55-IPC_C]
R305  100R  [FP-RC0603-0_55-MFG]
R306  100R  [FP-RC0603-0_55-MFG]
R307  100R  [FP-RC0603-0_55-MFG]
R308  10k  [FP-RC0603-0_55-IPC_C]
R309  100R  [FP-RC0603-0_55-MFG]
R310  100R  [FP-RC0603-0_55-MFG]
R311  100R  [FP-RC0603-0_55-MFG]
R312  100R  [FP-RC0603-0_55-MFG]
SW300  B3F-3122  [FP-B3F-3122-MFG]  (value not drawn)
SW301  B3F-3122  [FP-B3F-3122-MFG]  (value not drawn)
SW302  B3F-3122  [FP-B3F-3122-MFG]  (value not drawn)
TP300  TestPoint  [TestPoint]  (no BOM)
TP301  TestPoint  [TestPoint]  (no BOM)
TP302  TestPoint  [TestPoint]  (no BOM)
TP303  TestPoint  [TestPoint]  (no BOM)
TP304  TestPoint  [TestPoint]  (no BOM)
TP305  TestPoint  [TestPoint]  (no BOM)
TP306  TestPoint  [TestPoint]  (no BOM)
TP307  TestPoint  [TestPoint]  (no BOM)
TP308  TestPoint  [TestPoint]  (no BOM)
TP309  TestPoint  [TestPoint]  (no BOM)
TP310  TestPoint  [TestPoint]  (no BOM)
TP311  TestPoint  [TestPoint]  (no BOM)
U300  SN65HVD230DR  [FP-D0008A-IPC_A]
U301  SN65HVD230DR  [FP-D0008A-IPC_A]
U302  STM32F405RGT6  [STM-LQFP64_M]  (parts A,B of 2)
Y300  8MHz  [FP-7M-MFG]

### Blocks framed on the sheet
uC power supply: C300-C306 L300 U302
CAN1 transciever: C307 R300 U300
CAN2 transciever: C308 R301 U301
uC: C312-C315 R308 U302 Y300
Reset & user buttons: C309-C311 R302-R307 SW300-SW302 TP300-TP302
Programming connector: P300 TP303 TP304 TP310 TP311
User LEDs: LD300 LD301 R309-R312 TP305-TP309
Testpoints: J300-J303

### Ports
CAN_1_N (bidir, see main[6B]), CAN_1_P (bidir, see main[6B]), CAN_2_N (bidir, see main[6B]), CAN_2_P (bidir, see main[6B]), Health_Led (out, see main[6B]), NRST (in, see main[7C], ShieldConnectors[1C]), PA0 (bidir, see main[7B], ShieldConnectors[1C]), PA1 (bidir, see main[7C], ShieldConnectors[2D]), PA2 (bidir, see main[7B], ShieldConnectors[2C]), PA3 (bidir, see main[7B], ShieldConnectors[2C]), PA4 (bidir, see main[7B], ShieldConnectors[1C]), PA5 (bidir, see main[7B], ShieldConnectors[2B]), PA6 (bidir, see main[7B], ShieldConnectors[2C]), PA7 (bidir, see main[7B], ShieldConnectors[2C]), PA8 (bidir, see main[7B], ShieldConnectors[2C]), PA9 (bidir, see main[7B], ShieldConnectors[2C]), PA10 (bidir, see main[7B], ShieldConnectors[2C]), PA15 (bidir, see main[7B], ShieldConnectors[1D]), PB7 (bidir, see main[7B], ShieldConnectors[1D]), PB8 (bidir, see main[7B], ShieldConnectors[4B]), PB9 (bidir, see main[7B], ShieldConnectors[4C]), PB10 (bidir, see main[7B], ShieldConnectors[2C]), PB11 (bidir, see main[7B], ShieldConnectors[1D]), PB14 (bidir, see main[7B], ShieldConnectors[2C]), PB15 (bidir, see main[7B], ShieldConnectors[2C]), PC0 (bidir, see main[7B], ShieldConnectors[1C]), PC1 (bidir, see main[7B], ShieldConnectors[1C]), PC2 (bidir, see main[7B], ShieldConnectors[1C]), PC3 (bidir, see main[7B], ShieldConnectors[1C]), PC4 (bidir, see main[7C], ShieldConnectors[2C]), PC5 (bidir, see main[7C], ShieldConnectors[1D]), PC6 (bidir, see main[7C], ShieldConnectors[1D]), PC7 (bidir, see main[7C], ShieldConnectors[2C]), PC8 (bidir, see main[7C], ShieldConnectors[2D]), PC9 (bidir, see main[7C], ShieldConnectors[2D]), PC10 (bidir, see main[7C], ShieldConnectors[2D]), PC11 (bidir, see main[7C], ShieldConnectors[2D]), PC12 (bidir, see main[7C], ShieldConnectors[2D]), PC13 (bidir, see main[7C], ShieldConnectors[2C]), PC14 (bidir, see main[7C], ShieldConnectors[1D]), PC15 (bidir, see main[7C], ShieldConnectors[1D]), PD2 (bidir, see main[7C], ShieldConnectors[2D])

### Nets
3,3V: C300.2 C301.1 C302.1 C303.1 C304.1 C305.1 C307.1 C308.1 L300.1 R302.2 R303.2 R304.2 U300.3(VCC) U301.3(VCC) U302.1(VBAT) U302.19(VDD) U302.32(VDD) U302.48(VDD) U302.64(VDD)
3,3V_STLINK: P300.7 P300.8 TP303.1
3,3VDDA: C306.2 L300.2 U302.13(VDDA)
5V_STLINK: P300.9 P300.10 TP304.1
GND: C300.1 C301.2 C302.2 C303.2 C304.2 C305.2 C306.1 C307.2 C308.2 C309.2 C310.2 C311.2 C312.2 C313.2 C314.2 C315.2 J300.2(MNT_1) J300.3(MNT_2) J300.4(MNT_3) J300.5(MNT_4) J301.2(MNT_1) J301.3(MNT_2) J301.4(MNT_3) J301.5(MNT_4) J302.2(MNT_1) J302.3(MNT_2) J302.4(MNT_3) J302.5(MNT_4) J303.2(MNT_1) J303.3(MNT_2) J303.4(MNT_3) J303.5(MNT_4) P300.5 P300.6 R300.1 R301.1 R308.1 R309.2 R310.2 R311.2 R312.2 SW300.2 SW300.3(GND) SW300.4(GND) SW301.2 SW301.3(GND) SW301.4(GND) SW302.2 SW302.3(GND) SW302.4(GND) U300.2(GND) U301.2(GND) U302.12(VSSA) U302.18(VSS) U302.63(VSS) Y300.2(GND) Y300.4(GND)
CAN1_RX: J300.1 U300.4(R) U302.44(PA11)
CAN1_TX: J301.1 U300.1(D) U302.45(PA12)
CAN2_RX: U301.4(R) U302.33(PB12)
CAN2_TX: U301.1(D) U302.34(PB13)
CAN_1_N: J303.1 U300.6(CANL) ; port CAN_1_N  [project net CAN1_N]
CAN_1_P: J302.1 U300.7(CANH) ; port CAN_1_P  [project net CAN1_P]
CAN_2_N: U301.6(CANL) ; port CAN_2_N
CAN_2_P: U301.7(CANH) ; port CAN_2_P
NRST: P300.1 R305.1 SW300.1 TP300.1 U302.7(NRST) ; port NRST
OSC_IN: C313.1 U302.5(PH0-OSC_IN(PH0)) Y300.3
OSC_OUT: C312.1 U302.6(PH1-OSC_OUT(PH1)) Y300.1
PA0: U302.14(PA0-WKUP(PA0)) ; port PA0
PA1: U302.15(PA1) ; port PA1
PA2: U302.16(PA2) ; port PA2
PA3: U302.17(PA3) ; port PA3
PA4: U302.20(PA4) ; port PA4
PA5: U302.21(PA5) ; port PA5
PA6: U302.22(PA6) ; port PA6
PA7: U302.23(PA7) ; port PA7
PA8: U302.41(PA8) ; port PA8
PA9: U302.42(PA9) ; port PA9
PA10: U302.43(PA10) ; port PA10
PA15: U302.50(PA15(JTDI)) ; port PA15
PB7: U302.59(PB7) ; port PB7
PB8: U302.61(PB8) ; port PB8  [project net LV_CL]
PB9: U302.62(PB9) ; port PB9  [project net LV_DA]
PB10: U302.29(PB10) ; port PB10
PB11: U302.30(PB11) ; port PB11
PB14: U302.35(PB14) ; port PB14
PB15: U302.36(PB15) ; port PB15
PC0: U302.8(PC0) ; port PC0
PC1: U302.9(PC1) ; port PC1
PC2: U302.10(PC2) ; port PC2
PC3: U302.11(PC3) ; port PC3
PC4: U302.24(PC4) ; port PC4
PC5: U302.25(PC5) ; port PC5
PC6: U302.37(PC6) ; port PC6
PC7: U302.38(PC7) ; port PC7
PC8: U302.39(PC8) ; port PC8
PC9: U302.40(PC9) ; port PC9
PC10: U302.51(PC10) ; port PC10
PC11: U302.52(PC11) ; port PC11
PC12: U302.53(PC12) ; port PC12
PC13: U302.2(PC13) ; port PC13
PC14: U302.3(PC14-OSC32_IN(PC14)) ; port PC14
PC15: U302.4(PC15-OSC32_OUT(PC15)) ; port PC15
RS1: R300.2 U300.8(RS)
RS2: R301.2 U301.8(RS)
SWCLK: P300.2 TP310.1 U302.49(PA14(JTCK-SWCLK))
SWDIO: P300.4 TP311.1 U302.46(PA13(JTMS-SWDIO))
USER_BUTTON_0: R306.1 SW301.1 TP301.1 U302.26(PB0)
USER_BUTTON_1: R307.1 SW302.1 TP302.1 U302.27(PB1)
USER_LED_0: TP309.1 U302.28(PB2-BOOT1(PB2)) ; port Health_Led
USER_LED_1: LD300.1 TP305.1 U302.55(PB3(JTDO/TRACESWO))
USER_LED_2: LD300.3 TP306.1 U302.56(PB4(NJTRST))
USER_LED_3: LD301.1 TP307.1 U302.57(PB5)
USER_LED_4: LD301.3 TP308.1 U302.58(PB6)
VCAP_1: C315.1 U302.31(VCAP_1)
VCAP_2: C314.1 U302.47(VCAP_2)
NetC309_1: C309.1 R302.1 R305.2
NetC310_1: C310.1 R303.1 R306.2
NetC311_1: C311.1 R304.1 R307.2
NetJ8_4: U302.54(PD2) ; port PD2
NetLD300_2: LD300.2 R309.1
NetLD300_4: LD300.4 R310.1
NetLD301_2: LD301.2 R311.1
NetLD301_4: LD301.4 R312.1
NetR308_2: R308.2 U302.60(BOOT0)

Not connected (* = marked no-connect by the designer): P300 3*; U300 5(VREF)*; U301 5(VREF)*

### Layout directives
differential pair: CAN1_N, CAN1_P, CAN_2_N, CAN_2_P

### Notes on the sheet
- (near P300) SWIM NC
- C312 = C313 = (CL - 4pF) * 2
- Microcontroller & CAN
- Base_board
- A
- Dominik Pluta, Artem Horiunov
- (in symbol DoubleStack_Side_Led_3mm) Lower; Upper

### Library data of the parts
C300 = CMP-2006-03238-1: Part Number: C0603C475K8PACTU; Manufacturer: Kemet
C301-C305 C307-C311 = CMP-2006-03061-2: as C200 on sheet power; Temperature: -55°C to +125°C; RoHS: TRUE; Temperature Range High: +125°C; Lead Free: Yes; Octopart: https://octopart.com/c0603c104k5ractu-kemet-139244; Digikey Description: CAP CER 0.1UF 50V X7R 0603; Category: Cap; Package: C0603C-CF; ComponentLink2Description: Datasheet; Temperature Range Low: -55°C; Device Class L1: Passive Components; Voltage Rating: 50 V; Automotive: Yes; Device Class L3: Ceramic Capacitors; ComponentLink2URL: https://api.kemet.com/component-edge/download/datasheet/C0603C100J5GACAUTO.pdf; Capacitance: 0.10 μF; Device Class L2: Capacitors; Temperature Characteristic: X7R; Height: 0.87mm
C306 = CMP-2000-06025-2: Multilayer Ceramic Capacitors 1μF ±10% 50V X5R SMD 0603; Lead Free: Lead Free; Height: 0.8mm; Mount: Surface Mount; Radiation Hardening: No; Thickness: 0.035inch; Length: 1.6mm; Max Operating Temperature: 85°C; REACH SVHC: No SVHC; Min Operating Temperature: -55°C; Construction: Flat; RoHS Compliant: Yes; Voltage Rating: 50V; Dielectric: X5R; Packaging: Tape and Reel; Termination: SMD/SMT; Voltage Rating (DC): 50V; Case Code (Imperial): 0603; Voltage: 50V; Width: 0.031inch; Weight: 7.1E-05oz; Capacitance: 1uF; Depth: 0.8mm; Case Code (Metric): 1608; Series: C; Case/Package: 0603; Tolerance: 10%; Resistor Type: Ceramic; Number of Pins: 2; Dielectric Material: Ceramic; Package Quantity: 1
C312 C313 = CMP-1035-00783-3: CAP CER 20PF 50V 5% NP0 0603; Manufacturer Part Number: C0603C200J5GACTU; Manufacturer: KEMET; Temperature Coefficient: 30ppm/°C; Temperature Characteristic: C0G; Automotive Grade: Grade 1; Tolerance: 0.05; Material: Ceramic; Category: Cap; Temperature Range Low: -55°C; RoHS: TRUE; ComponentLink2URL: https://api.kemet.com/component-edge/download/datasheet/C0603C100J5GACAUTO.pdf; Package: C0603C-CF; Height: 0.87mm; Capacitance: 20 pF; Voltage Rating: 50 V; Octopart: https://octopart.com/c0603c200j5gactu-kemet-9138585; Device Class L1: Passive Components; Automotive: Yes; Digikey Description: CAP CER 20PF 50V 5% NP0 0603; Temperature Range High: +125°C; Device Class L3: Ceramic Capacitors; Mouser Description: Multilayer Ceramic Capacitors MLCC - SMD/SMT 50volts 20pF C0G 5%; ComponentLink2Description: Datasheet; Device Class L2: Capacitors; Lead Free: Yes; Temperature: -55°C to +125°C; Value: 20 pF
C314 C315 = CMP-2006-02836-2: Chip Multilayer Ceramic Capacitors for General Purpose, 0603, 2.2uF, X7R, 15%, 10%, 10V; Case Code (Metric): 1608; Height: 0.8mm; Packaging: Cut Tape; Voltage: 10V; Lead Free: Lead Free; Min Operating Temperature: -55°C; Voltage Rating (DC): 10V; Max Operating Temperature: 125°C; Voltage Rating: 10V; Dielectric: X7R; Depth: 0.8mm; Case Code (Imperial): 0603; Termination: SMD/SMT; Case/Package: 0603; Number of Pins: 2; REACH SVHC: No SVHC; Mount: Surface Mount; Width: 0.031inch; Material: Ceramic; Capacitance: 2.2uF; Package Quantity: 1; Weight: 7.1E-05oz; Length: 1.6mm; Thickness: 0.035inch; Tolerance: 10%
J300-J303 = CMP-00257-24916978-1: 73415-1472 50 Ohms, MMCX Vertical Jack, PCB, Brass and Gold Per Commercial Requirements, One Piece Per Bag; Manufacturer Lifecycle Status: ACTIVE; Dielectric Material: Teflon; Number of Contacts: 1; Resistance: 50Ω; Voltage Rating: 170V; Frequency: 6GHz; Orientation: Straight; Min Operating Temperature: -55°C; Height: 4.55mm; Max Operating Temperature: 165°C; Country of Origin: TW; Lifecycle Status: Production; Packaging: Bulk; Halogen Free: Low Halogen; NexarPartId: 24916978; RoHS: Non-Compliant; Contact Material: Gold; Impedance: 50Ω; Mount: Through Hole
L300 = CMP-06042-016801-1: Multilayer Type Inductor for General Circuits, 0805 (2012), 22μH, 30%, 0.65Ω, 13mA; Shielding: Shielded; Inductance Tolerance: 10%; Core Material: Ferrite; DC Resistance (DCR): 1R; Test Frequency: 10MHz; Current Rating: 30mA; Inductance: 4.7uH; Self Resonant Frequency: 47MHz; Q Factor: 45; Packaging: Tape and Reel; Width: 1.25mm; Package Quantity: 1; REACH SVHC: No SVHC; Min Operating Temperature: -40°C; Tolerance: 10%; Lead Free: Lead Free; Depth: 1.45mm; Termination: SMD/SMT; Case Code (Imperial): 0805; Case Code (Metric): 2012; Rated Current-Max: 30mA; Military Standard: Not; Length: 2mm; Series: LQM21N; Case/Package: 0805; Max DC Current: 30mA; DC Current: 30mA; Mount: Surface Mount; Height: 0.85mm; Max Operating Temperature: 85°C; Radiation Hardening: No
LD300 LD301 = DoubleStack_Side_Led_3mm
P300 = CMP-1502-00021-2: NexarPartId: 8917787; Operating Supply Voltage: 250V; Number of Positions: 10; Contact Resistance: 20mΩ; Connector Type: Male Pin; Current Rating: 3A; Pitch: 2.54mm; Gender: Male; Insulation Resistance: 1GΩ; Insulation: Insulated; Max Operating Temperature: 105°C; Flammability Rating: UL94 V-0; Mount: Through Hole; Contact Material: Copper; Min Operating Temperature: -40°C; Length: 20.36mm; Number of Contacts: 10; Height: 8.85mm; Number of Rows: 2; Housing Material: PBT; Color: Black; Contact Gender: Male; Orientation: Right Angle; Contact Plating: Gold; Number of Pins: 10; Voltage Rating (DC): 250V; RoHS: Compliant; Insulation Material: PBT; REACH SVHC: Unknown; Row Spacing: 2.54mm; Voltage Rating: 250V; Width: 20.36mm; Lead Pitch: 2.54mm; Termination: Through Hole
R300-R304 R308 = CMP-2100-03664-2: as R200 on sheet power; Depth: 0.8mm; Termination: SMD/SMT; Resistor Type: Thick Film; Series: RC; Construction: Rectangular; Features: Moisture Resistant; Packaging: Tape and Reel; Min Operating Temperature: -55°C; Number of Terminations: 2; Lead Pitch: 0.3mm; RoHS Compliant: Yes; Case/Package: 0603; Resistance Tolerance: 1%; Military Standard: Not; Weight: 7.1E-05oz; Number of Pins: 2; Tolerance: 1%; Length: 1.6mm; Case Code (Imperial): 0603; Lead Free: Lead Free; Width: 0.8mm; Max Power Dissipation: 100mW; Height: 0.45mm; Max Operating Temperature: 155°C; Case Code (Metric): 1608; Size Code: 0603
R305-R307 R309-R312 = CMP-2100-03663-2: as R208 on sheet power; Case/Package: 0603; Military Standard: Not; REACH SVHC: Unknown; Case Code (Metric): 0603; Max Operating Temperature: 155°C; Schedule B: 8533210045, 8533210045; Height: 450µm; Length: 1.6mm; Lead Free: Lead Free; Packaging: Tape & Reel; Case Code (Imperial): 0603; Composition: Thick Film; Min Operating Temperature: -55°C; Voltage Rating (DC): 50V; RoHS: Compliant; Depth: 800µm; Number of Pins: 2; Termination: SMD/SMT; Width: 800µm
SW300-SW302 = CMP-08834-000053-1: SWITCH TACTILE SPST-NO 0.05A 24V; Max Current Rating: 50mA; Actuator Type: Standard; Ratings: IP00; Number of Poles: 1; Mechanical Life: 300000Cycles; Illumination Type: Non-Illuminated; Switch Function: Off-Mom; Actuator Color: Grey; Contact Resistance: 100mR; Throw Configuration: SPST; Actuator Length: 1.6mm; Switch Travel: 0.25mm; Operating Force: 1.47N; Weight: 0.25g; Voltage Rating (DC): 24V; Contact Plating: Gold; RoHS Compliant: Yes; Contact Material: Gold; Radiation Hardening: No; Packaging: Bulk; Height: 7.4mm; Min Operating Temperature: -25°C; Electrical Life: 300000Cycles; Depth: 7.85mm; Max Voltage Rating (DC): 24V; Mount: Through Hole; Width: 6.25mm; Current Rating: 50mA; Lead Free: Lead Free; Max Operating Temperature: 70°C; Series: B3F; Contact Current Rating: 50mA; Package Quantity: 1000; Termination: PC Pins; Orientation: Right Angle; Length: 7.3mm
U300 U301 = CMP-0315-00015-3: IC TRANSCEIVER HALF 1/1 8SOIC; Number of Transceivers: 1; Operating Supply Voltage: 3.3V; Number of I/Os: 2; Max Supply Current: 17mA; Max Supply Voltage: 3.6V; Min Supply Voltage: 3V; Data Rate: 1Mbps; Min Operating Temperature: -40°C; Packaging: Tape and Reel; Lead Free: Lead Free; Number of Transmit Buffers: 1; Max Operating Temperature: 85°C; Number of Receive Buffers: 1; Number of Pins: 8; Package Quantity: 1; Radiation Hardening: No; Case/Package: D; REACH SVHC: No SVHC; Weight: 0.002561oz; Termination: SMD/SMT; Contact Plating: Gold; Nominal Supply Current: 17mA; Number of Receivers: 1; Number of Drivers: 1
U302 = CMP-0243-00019-3: ARM Cortex-M4 32-bit MCU+FPU, 210 DMIPS, 1024 kB Flash, 192 kB Internal RAM, 51 I/Os, 64-pin LQFP, -40 to 85 degC, Tray; Manufacturer: STMicroelectronics; Supply Voltage(Vcc) min (V): 1.8; Supply Voltage(Vcc) max (V): 3.6; Internal RAM Size (kB): 192; I/Os (High Current): 51; D/A Converter: 2x12-bit; FLASH Size (Prog) (kB): 1024; Operating Frequency(F) (Processor speed) (MHz): 168; ComponentLink2Description: Datasheet; PackageVersion: Rev. 4, 06/2013; DatasheetVersion: Rev. 4; Core: ARM Cortex-M4; ComponentLink2URL: http://www.st.com/st-web-ui/static/active/en/resource/technical/document/datasheet/DM00037051.pdf; PackageReference: LQFP64; Packing: Tray; ComponentLink1Description: Manufacturer URL; ComponentLink3URL: http://www.st.com/st-web-ui/static/active/en/resource/technical/document/datasheet/DM00037051.pdf; ComponentLink3Description: Package Specification; Mounting Technology: Surface Mount; ComponentLink1URL: http://www.st.com/web/en/home.html; PackageDescription: 64-Pin Low Profile Quad Flat Package, 10 x 10 mm Body, 0.5 mm Pitch; PartNumber: STM32F405RGT6
Y300 = CMP-18717-000311-1: Crystal; ESR (Equivalent Series Resistance): 100R; Frequency: 12MHz; Frequency Stability: 10ppm; Load Capacitance: 10pF; Width: 0.098inch; Number of Pins: 4; Case/Package: SMD/SMT; REACH SVHC: No SVHC; Mount: Surface Mount; Max Operating Temperature: 70°C; RoHS Compliant: Yes; Depth: 2.5mm; Length: 3.2mm; Termination: SMD/SMT; Frequency Tolerance: 10ppm; Min Operating Temperature: -20°C; Series: 7M; Packaging: Tape and Reel; Tolerance: 10ppm; Height: 0.031inch; Package Quantity: 3000